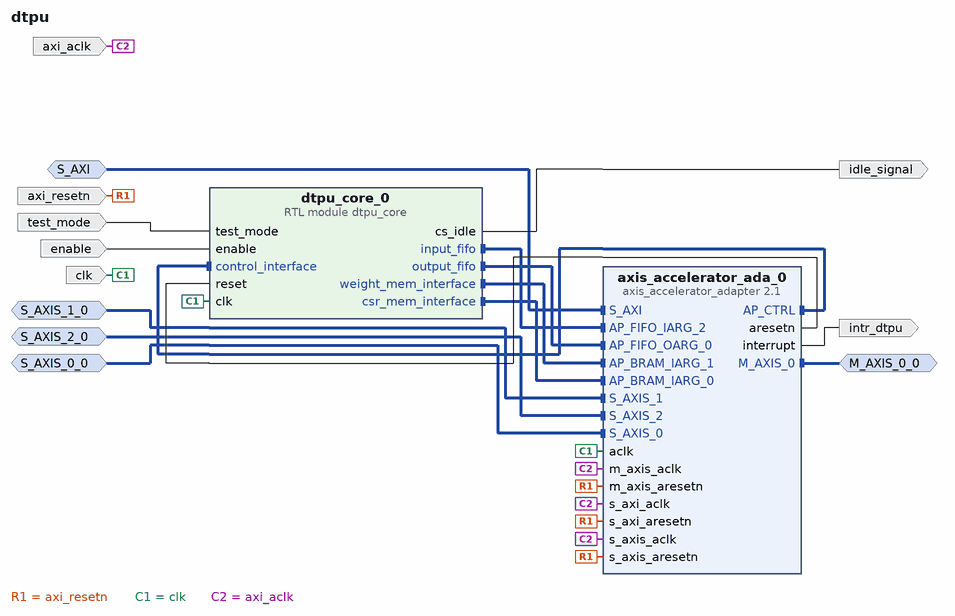
[diagram p0: block diagram of the top level]
# Vivado block design dtpu, xc7z020clg400-1, Vivado 2019.2.1
create_bd_design dtpu

create_bd_intf_port -mode Slave -vlnv xilinx.com:interface:aximm_rtl:1.0 S_AXI
set_property -dict [list \
  CONFIG.DATA_WIDTH 32 \
  CONFIG.PROTOCOL AXI4LITE \
  CONFIG.FREQ_HZ 100000000 \
  CONFIG.ID_WIDTH 0 \
  CONFIG.ADDR_WIDTH 32 \
  CONFIG.AWUSER_WIDTH 0 \
  CONFIG.ARUSER_WIDTH 0 \
  CONFIG.WUSER_WIDTH 0 \
  CONFIG.RUSER_WIDTH 0 \
  CONFIG.BUSER_WIDTH 0 \
  CONFIG.READ_WRITE_MODE READ_WRITE \
  CONFIG.HAS_BURST 0 \
  CONFIG.HAS_LOCK 0 \
  CONFIG.HAS_PROT 0 \
  CONFIG.HAS_CACHE 0 \
  CONFIG.HAS_QOS 0 \
  CONFIG.HAS_REGION 0 \
  CONFIG.HAS_WSTRB 1 \
  CONFIG.HAS_BRESP 1 \
  CONFIG.HAS_RRESP 1 \
  CONFIG.SUPPORTS_NARROW_BURST 0 \
  CONFIG.NUM_READ_OUTSTANDING 1 \
  CONFIG.NUM_WRITE_OUTSTANDING 1 \
  CONFIG.MAX_BURST_LENGTH 1 \
  CONFIG.NUM_READ_THREADS 1 \
  CONFIG.NUM_WRITE_THREADS 1 \
  CONFIG.RUSER_BITS_PER_BYTE 0 \
  CONFIG.WUSER_BITS_PER_BYTE 0 \
] [get_bd_intf_ports S_AXI]
create_bd_intf_port -mode Master -vlnv xilinx.com:interface:axis_rtl:1.0 M_AXIS_0_0
set_property -dict {CONFIG.FREQ_HZ 100000000} [get_bd_intf_ports M_AXIS_0_0]
create_bd_intf_port -mode Slave -vlnv xilinx.com:interface:axis_rtl:1.0 S_AXIS_1_0
set_property -dict [list \
  CONFIG.TDATA_NUM_BYTES 8 \
  CONFIG.TDEST_WIDTH 4 \
  CONFIG.TID_WIDTH 4 \
  CONFIG.TUSER_WIDTH 8 \
  CONFIG.HAS_TREADY 1 \
  CONFIG.HAS_TSTRB 0 \
  CONFIG.HAS_TKEEP 0 \
  CONFIG.HAS_TLAST 1 \
  CONFIG.FREQ_HZ 100000000 \
  CONFIG.LAYERED_METADATA undef \
] [get_bd_intf_ports S_AXIS_1_0]
create_bd_intf_port -mode Slave -vlnv xilinx.com:interface:axis_rtl:1.0 S_AXIS_0_0
set_property -dict [list \
  CONFIG.TDATA_NUM_BYTES 8 \
  CONFIG.TDEST_WIDTH 4 \
  CONFIG.TID_WIDTH 4 \
  CONFIG.TUSER_WIDTH 8 \
  CONFIG.HAS_TREADY 1 \
  CONFIG.HAS_TSTRB 0 \
  CONFIG.HAS_TKEEP 0 \
  CONFIG.HAS_TLAST 1 \
  CONFIG.FREQ_HZ 100000000 \
  CONFIG.LAYERED_METADATA undef \
] [get_bd_intf_ports S_AXIS_0_0]
create_bd_intf_port -mode Slave -vlnv xilinx.com:interface:axis_rtl:1.0 S_AXIS_2_0
set_property -dict [list \
  CONFIG.TDATA_NUM_BYTES 8 \
  CONFIG.TDEST_WIDTH 4 \
  CONFIG.TID_WIDTH 4 \
  CONFIG.TUSER_WIDTH 8 \
  CONFIG.HAS_TREADY 1 \
  CONFIG.HAS_TSTRB 0 \
  CONFIG.HAS_TKEEP 0 \
  CONFIG.HAS_TLAST 1 \
  CONFIG.FREQ_HZ 100000000 \
  CONFIG.LAYERED_METADATA undef \
] [get_bd_intf_ports S_AXIS_2_0]
create_bd_port -dir I test_mode
create_bd_port -dir I enable
create_bd_port -dir O -type intr intr_dtpu
create_bd_port -dir I -type clk clk
set_property -dict {CONFIG.FREQ_HZ 40000000} [get_bd_ports clk]
create_bd_port -dir I -type rst axi_resetn
create_bd_port -dir O idle_signal
create_bd_port -dir I -type clk axi_aclk
set_property -dict [list \
  CONFIG.ASSOCIATED_BUSIF S_AXI:S_AXIS_0_0:M_AXIS_0_0:S_AXIS_1_0:S_AXIS_2_0 \
  CONFIG.ASSOCIATED_RESET axi_resetn:axi_resetn \
  CONFIG.FREQ_HZ 100000000 \
] [get_bd_ports axi_aclk]

create_bd_cell -type ip -vlnv xilinx.com:ip:axis_accelerator_adapter:2.1 axis_accelerator_ada_0
set_property -dict [list \
  CONFIG.C_AP_IARG_0_DWIDTH 8 \
  CONFIG.C_AP_IARG_0_MB_DEPTH 1 \
  CONFIG.C_AP_IARG_1_DIM_1 2048 \
  CONFIG.C_AP_IARG_1_DWIDTH 64 \
  CONFIG.C_AP_IARG_1_MB_DEPTH 2 \
  CONFIG.C_AP_IARG_2_DIM_1 2048 \
  CONFIG.C_AP_IARG_2_DWIDTH 64 \
  CONFIG.C_AP_IARG_2_TYPE 1 \
  CONFIG.C_AP_OARG_0_DIM_1 2048 \
  CONFIG.C_AP_OARG_0_DWIDTH 64 \
  CONFIG.C_AP_OARG_0_TYPE 1 \
  CONFIG.C_IARG_HAS_BRAM 1 \
  CONFIG.C_IARG_HAS_FIFO 1 \
  CONFIG.C_N_INPUT_ARGS 3 \
  CONFIG.C_OARG_HAS_BRAM 0 \
  CONFIG.C_OARG_HAS_FIFO 1 \
  CONFIG.C_PRMRY_IS_ACLK_ASYNC 1 \
] [get_bd_cells axis_accelerator_ada_0]
create_bd_cell -type module -reference dtpu_core dtpu_core_0
set_property -dict {CONFIG.COLUMNS 3 CONFIG.ROWS 3} [get_bd_cells dtpu_core_0]

# ---- connections ----

connect_bd_intf_net [get_bd_intf_ports S_AXI] [get_bd_intf_pins axis_accelerator_ada_0/S_AXI]
connect_bd_intf_net -intf_net S_AXIS_1_0_1 [get_bd_intf_ports S_AXIS_1_0] [get_bd_intf_pins axis_accelerator_ada_0/S_AXIS_1]
connect_bd_intf_net [get_bd_intf_pins dtpu_core_0/input_fifo] [get_bd_intf_pins axis_accelerator_ada_0/AP_FIFO_IARG_2]
connect_bd_intf_net [get_bd_intf_pins dtpu_core_0/output_fifo] [get_bd_intf_pins axis_accelerator_ada_0/AP_FIFO_OARG_0]
connect_bd_intf_net -intf_net S_AXIS_2_0_1 [get_bd_intf_ports S_AXIS_2_0] [get_bd_intf_pins axis_accelerator_ada_0/S_AXIS_2]
connect_bd_intf_net [get_bd_intf_pins dtpu_core_0/weight_mem_interface] [get_bd_intf_pins axis_accelerator_ada_0/AP_BRAM_IARG_1]
connect_bd_intf_net [get_bd_intf_ports M_AXIS_0_0] [get_bd_intf_pins axis_accelerator_ada_0/M_AXIS_0]
connect_bd_intf_net [get_bd_intf_pins dtpu_core_0/csr_mem_interface] [get_bd_intf_pins axis_accelerator_ada_0/AP_BRAM_IARG_0]
connect_bd_intf_net -intf_net S_AXIS_0_0_1 [get_bd_intf_ports S_AXIS_0_0] [get_bd_intf_pins axis_accelerator_ada_0/S_AXIS_0]
connect_bd_intf_net [get_bd_intf_pins axis_accelerator_ada_0/AP_CTRL] [get_bd_intf_pins dtpu_core_0/control_interface]
connect_bd_net [get_bd_ports axi_resetn] \
  [get_bd_pins axis_accelerator_ada_0/m_axis_aresetn] [get_bd_pins axis_accelerator_ada_0/s_axis_aresetn] \
  [get_bd_pins axis_accelerator_ada_0/s_axi_aresetn]
connect_bd_net [get_bd_pins axis_accelerator_ada_0/interrupt] [get_bd_ports intr_dtpu]
connect_bd_net [get_bd_ports test_mode] [get_bd_pins dtpu_core_0/test_mode]
connect_bd_net [get_bd_ports enable] [get_bd_pins dtpu_core_0/enable]
connect_bd_net [get_bd_pins axis_accelerator_ada_0/aresetn] [get_bd_pins dtpu_core_0/reset]
connect_bd_net [get_bd_pins dtpu_core_0/cs_idle] [get_bd_ports idle_signal]
connect_bd_net [get_bd_ports clk] [get_bd_pins dtpu_core_0/clk] [get_bd_pins axis_accelerator_ada_0/aclk]
connect_bd_net [get_bd_ports axi_aclk] \
  [get_bd_pins axis_accelerator_ada_0/m_axis_aclk] [get_bd_pins axis_accelerator_ada_0/s_axis_aclk] \
  [get_bd_pins axis_accelerator_ada_0/s_axi_aclk]

# ---- address map ----
assign_bd_address -offset 0x00000000 -range 32K -target_address_space [get_bd_addr_spaces S_AXI] [get_bd_addr_segs axis_accelerator_ada_0/S_AXI/Reg]

set_property USER_COMMENTS.comment_0 {axi stream are for input/output  fifo and bram 
} [current_bd_design]

validate_bd_design
save_bd_design
